# Altium schematic sheet Motors_and_Servos.SchDoc: Science Sensor: Motors & Servos
size Letter; Author: Emela M.; Organization: Husky Robotics; Address1: University of Washington; Address2: Mechanical Engineering; Address3: Seattle, WA; Revision: A; SheetNumber: 2; SheetTotal: 6
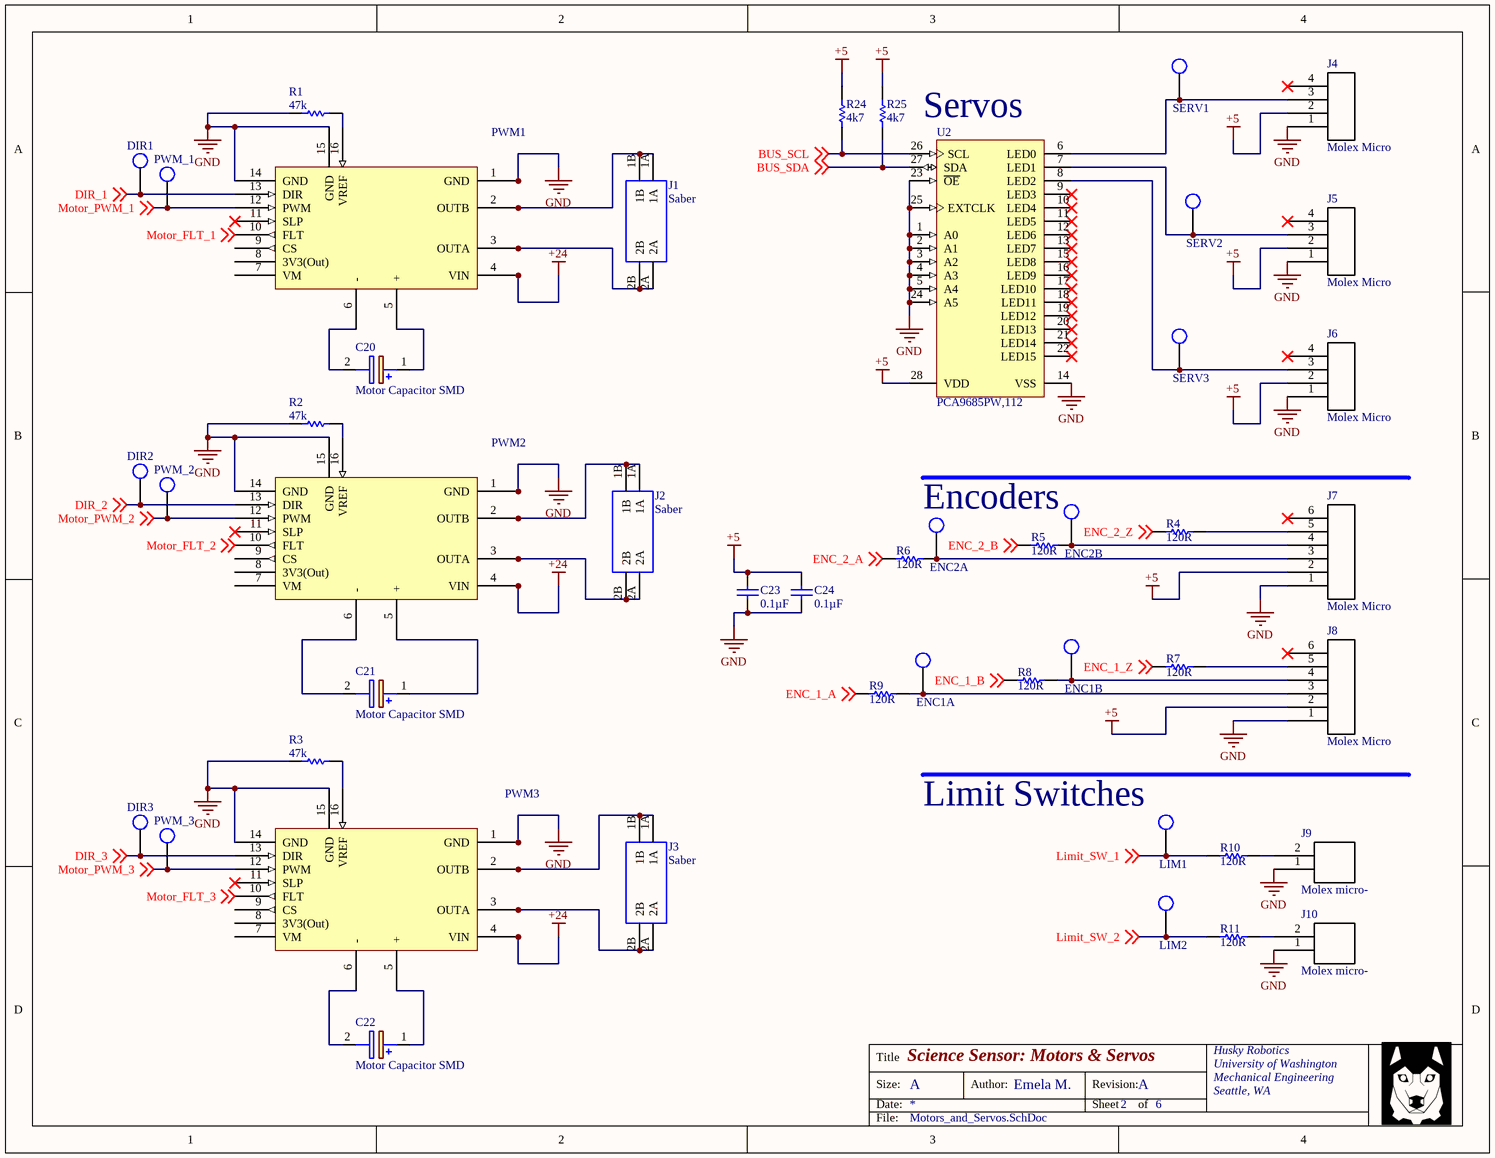
[diagram p0: Motors_and_Servos.SchDoc]

## Parts
C20  Motor Capacitor SMD  [CAP_SMD_CAN]
C21  Motor Capacitor SMD  [CAP_SMD_CAN]
C22  Motor Capacitor SMD  [CAP_SMD_CAN]
C23  Capacitance: 0.1µF  [Cap 0805]  (hidden comment: Capacitor 0805)
C24  Capacitance: 0.1µF  [Cap 0805]  (hidden comment: Capacitor 0805)
DIR1  Test Point  [Test Point Through-hole]  (value not drawn)
DIR2  Test Point  [Test Point Through-hole]  (value not drawn)
DIR3  Test Point  [Test Point Through-hole]  (value not drawn)
ENC1A  Test Point  [Test Point Through-hole]  (value not drawn)
ENC1B  Test Point  [Test Point Through-hole]  (value not drawn)
ENC2A  Test Point  [Test Point Through-hole]  (value not drawn)
ENC2B  Test Point  [Test Point Through-hole]  (value not drawn)
J1  Saber  [SABER R/A]
J2  Saber  [SABER R/A]
J3  Saber  [SABER R/A]
J4  Molex Micro  [MICROFIT R/A 4 PIN]
J5  Molex Micro  [MICROFIT R/A 4 PIN]
J6  Molex Micro  [MICROFIT R/A 4 PIN]
J7  Molex Micro  [MICROFIT R/A 6 PIN]
J8  Molex Micro  [MICROFIT R/A 6 PIN]
J9  Molex micro-  [microfit R/A 2 pin]
J10  Molex micro-  [microfit R/A 2 pin]
LIM1  Test Point  [Test Point Through-hole]  (value not drawn)
LIM2  Test Point  [Test Point Through-hole]  (value not drawn)
PWM1  6.5V - 40V  [Pololu_G2_Driver_24v21]  (value not drawn)
PWM2  6.5V - 40V  [Pololu_G2_Driver_24v21]  (value not drawn)
PWM3  6.5V - 40V  [Pololu_G2_Driver_24v21]  (value not drawn)
PWM_1  Test Point  [Test Point Through-hole]  (value not drawn)
PWM_2  Test Point  [Test Point Through-hole]  (value not drawn)
PWM_3  Test Point  [Test Point Through-hole]  (value not drawn)
R1  value 47k  [RESC0805(2012)_N]  (hidden comment: Resistor 0805)
R2  value 47k  [RESC0805(2012)_N]  (hidden comment: Resistor 0805)
R3  value 47k  [RESC0805(2012)_N]  (hidden comment: Resistor 0805)
R4  value 120R  [RESC0805(2012)_N]  (hidden comment: Resistor 0805)
R5  value 120R  [RESC0805(2012)_N]  (hidden comment: Resistor 0805)
R6  value 120R  [RESC0805(2012)_N]  (hidden comment: Resistor 0805)
R7  value 120R  [RESC0805(2012)_N]  (hidden comment: Resistor 0805)
R8  value 120R  [RESC0805(2012)_N]  (hidden comment: Resistor 0805)
R9  value 120R  [RESC0805(2012)_N]  (hidden comment: Resistor 0805)
R10  value 120R  [RESC0805(2012)_N]  (hidden comment: Resistor 0805)
R11  value 120R  [RESC0805(2012)_N]  (hidden comment: Resistor 0805)
R24  value 4k7  [RESC0805(2012)_N]  (hidden comment: Resistor 0805)
R25  value 4k7  [RESC0805(2012)_N]  (hidden comment: Resistor 0805)
SERV1  Test Point  [Test Point Through-hole]  (value not drawn)
SERV2  Test Point  [Test Point Through-hole]  (value not drawn)
SERV3  Test Point  [Test Point Through-hole]  (value not drawn)
U2  PCA9685PW,112  [SOT361-1_V]

## Nets
+5: C23.2 C24.2 J4.2 J5.2 J6.2 J7.2 J8.2 R24.2 R25.2 U2.28(VDD)
+24: PWM1.4(VIN) PWM1.4a(VIN) PWM1.4b(VIN) PWM2.4(VIN) PWM2.4a(VIN) PWM2.4b(VIN) PWM3.4(VIN) PWM3.4a(VIN) PWM3.4b(VIN)
GND: C23.1 C24.1 J4.1 J5.1 J6.1 J7.1 J8.1 J9.1 J10.1 PWM1.1(GND) PWM1.1a(GND) PWM1.1b(GND) PWM1.14(GND) PWM1.15(GND) PWM2.1(GND) PWM2.1a(GND) PWM2.1b(GND) PWM2.14(GND) PWM2.15(GND) PWM3.1(GND) PWM3.1a(GND) PWM3.1b(GND) PWM3.14(GND) PWM3.15(GND) R1.2 R2.2 R3.2 U2.1(A0) U2.2(A1) U2.3(A2) U2.4(A3) U2.5(A4) U2.14(VSS) U2.23(~{OE}) U2.24(A5) U2.25(EXTCLK)
BUS_SCL: R24.1 U2.26(SCL) ; off-sheet BUS_SCL
BUS_SDA: R25.1 U2.27(SDA) ; off-sheet BUS_SDA
DIR_1: DIR1.1 PWM1.13(DIR) ; off-sheet DIR_1
DIR_2: DIR2.1 PWM2.13(DIR) ; off-sheet DIR_2
DIR_3: DIR3.1 PWM3.13(DIR) ; off-sheet DIR_3
ENC_1_A: R9.1 ; off-sheet ENC_1_A
ENC_1_B: R8.1 ; off-sheet ENC_1_B
ENC_1_Z: R7.1 ; off-sheet ENC_1_Z
ENC_2_A: R6.1 ; off-sheet ENC_2_A
ENC_2_B: R5.1 ; off-sheet ENC_2_B
ENC_2_Z: R4.1 ; off-sheet ENC_2_Z
Limit_SW_1: LIM1.1 R10.1 ; off-sheet Limit_SW_1
Limit_SW_2: LIM2.1 R11.1 ; off-sheet Limit_SW_2
Motor_FLT_1: PWM1.10(FLT) ; off-sheet Motor_FLT_1
Motor_FLT_2: PWM2.10(FLT) ; off-sheet Motor_FLT_2
Motor_FLT_3: PWM3.10(FLT) ; off-sheet Motor_FLT_3
Motor_PWM_1: PWM1.12(PWM) PWM_1.1 ; off-sheet Motor_PWM_1
Motor_PWM_2: PWM2.12(PWM) PWM_2.1 ; off-sheet Motor_PWM_2
Motor_PWM_3: PWM3.12(PWM) PWM_3.1 ; off-sheet Motor_PWM_3
NetC20_1: C20.1(+) PWM1.5(+)
NetC20_2: C20.2(-) PWM1.6(-)
NetC21_1: C21.1(+) PWM2.5(+)
NetC21_2: C21.2(-) PWM2.6(-)
NetC22_1: C22.1(+) PWM3.5(+)
NetC22_2: C22.2(-) PWM3.6(-)
NetENC1A_1: ENC1A.1 J8.3 R9.2
NetENC1B_1: ENC1B.1 J8.4 R8.2
NetENC2A_1: ENC2A.1 J7.3 R6.2
NetENC2B_1: ENC2B.1 J7.4 R5.2
NetJ1_1A: J1.1A J1.1B PWM1.2(OUTB) PWM1.2a(OUTB) PWM1.2b(OUTB)
NetJ1_2A: J1.2A J1.2B PWM1.3(OUTA) PWM1.3a(OUTA) PWM1.3b(OUTA)
NetJ2_1A: J2.1A J2.1B PWM2.2(OUTB) PWM2.2a(OUTB) PWM2.2b(OUTB)
NetJ2_2A: J2.2A J2.2B PWM2.3(OUTA) PWM2.3a(OUTA) PWM2.3b(OUTA)
NetJ3_1A: J3.1A J3.1B PWM3.2(OUTB) PWM3.2a(OUTB) PWM3.2b(OUTB)
NetJ3_2A: J3.2A J3.2B PWM3.3(OUTA) PWM3.3a(OUTA) PWM3.3b(OUTA)
NetJ4_3: J4.3 SERV1.1 U2.6(LED0)
NetJ5_3: J5.3 SERV2.1 U2.7(LED1)
NetJ6_3: J6.3 SERV3.1 U2.8(LED2)
NetJ7_5: J7.5 R4.2
NetJ8_5: J8.5 R7.2
NetJ9_2: J9.2 R10.2
NetJ10_2: J10.2 R11.2
NetPWM1_16: PWM1.16(VREF) R1.1
NetPWM2_16: PWM2.16(VREF) R2.1
NetPWM3_16: PWM3.16(VREF) R3.1

Not connected (* = marked no-connect by the designer): J4 4*; J5 4*; J6 4*; J7 6*; J8 6*; PWM1 7(VM) 8(3V3(Out)) 9(CS) 11(SLP)*; PWM2 7(VM) 8(3V3(Out)) 9(CS) 11(SLP)*; PWM3 7(VM) 8(3V3(Out)) 9(CS) 11(SLP)*; U2 9(LED3)* 10(LED4)* 11(LED5)* 12(LED6)* 13(LED7)* 15(LED8)* 16(LED9)* 17(LED10)* 18(LED11)* 19(LED12)* 20(LED13)* 21(LED14)* 22(LED15)*

## Notes on the sheet
- Servos
- (near ENC2B) Encoders
- (near LIM1) Limit Switches
- Title
- Size:
- Date:
- A
- Author:
- Revision:
- Sheet
- of
- File:

## Library data of the parts
C20-C22 = Motor Capacitor SMD: Capacitor Polarised; Manufacturer_Name: Panasonic; Manufacturer_Part_Number: EEE-FK1V331AP; Datasheet Link: https://www.arrow.com/en/products/eee-fk1v331ap/panasonic; Height: 10.5mm; Arrow Part Number: EEE-FK1V331AP; Arrow Price/Stock: https://www.arrow.com/en/products/eee-fk1v331ap/panasonic; Mouser Part Number: 667-EEE-FK1V331AP; Mouser Price/Stock: http://www.mouser.com/Search/ProductDetail.aspx?qs=fgLb7gR0z4waT8A8J1cE1w%3d%3d
C23 C24 = Capacitor 0805: Standard Capacitor; Manufacturer: AVX; Tolerance (%): ±10%; Dielectric: X5R; Rated Voltage: 10V; Datasheet Version: 05/2016; Manufacturer URL: http://www.avx.com/; Package Description: 2-Pin Surface Mount Device, Body 2.01 x 1.25 mm; Mounting Technology: SurfaceMount; Case Size/Dimension: 0805; Package Reference: 0805; Datasheet URL: http://datasheets.avx.com/cx5r.pdf
J4-J6 = Molex micro-fit 4-pin (Single row schematic): Molex micro-fit 3.0 dual row header. P/N 0430450427
J7 J8 = Molex micro-fit 6-pin (single row schematic): Molex micro-fit 3.0 dual row connector. P/N 0430450627
J9 J10 = Molex micro-fit 2-pin: Molex micro-fit 3.0. Molex P/N 0430450227
PWM1-PWM3 = Pololu G2 High-Power Motor Driver 24v21: This discrete MOSFET H-bridge motor driver enables bidirectional control of one high-power DC brushed motor. The small 1.3″ × 0.8″ board supports a wide 6.5 V to 40 V voltage range and is efficient enough to deliver a continuous 21 A without a heat sink. Additional features of this second-generation (G2) driver include reverse-voltage protection along with basic current sensing and current limiting functionality.; ComponentLink1Description: Product Info; ComponentLink1URL: https://www.pololu.com/product/2995/specs
R1-R11 R24 R25 = Resistor 0805: Generic 0805 Resistor; Tolerance: 5 %; Case-Metric: 2012; Case-EIA: 0805; Power: 0.125 W; Technology: SMT
U2 = CMP-1595-00004-2: 16-Channel, 12-Bit PWM Fm+ I2C-Bus LED Controller, 2.3 to 5.5 V, -40 to 85 degC, 28-Pin TSSOP (SOT361-1), RoHS, Tape and Reel; Supply Current Max: 10 mA; Supply Voltage Min: 2.3 V; Supply Voltage Max: 5.5 V; Frequency: 25000000 Hz; Temperature Min: -40 degC; PackageDescription: 28-Pin Small Outline Package, Body 9.7 x 4.4 mm, Pitch 0.65 mm; RoHS: TRUE; ComponentLink1Description: Manufacturer URL; Code_JEDEC: MO-153; PartNumber: PCA9685; ComponentLink2URL: http://www.nxp.com/documents/data_sheet/PCA9685.pdf; Packing: Tape and Reel; ComponentLink1URL: http://www.nxp.com/; ComponentLink3Description: Package Specification; ComponentLink2Description: Datasheet; ComponentLink3URL: http://www.nxp.com/documents/outline_drawing/sot361-1_po.pdf; DatasheetVersion: Rev. 4; Temperature Max: 85 degC; PackageVersion: 02/2003; Mounting Technology: Surface Mount